# Altium schematic sheet usd.SchDoc
size A4
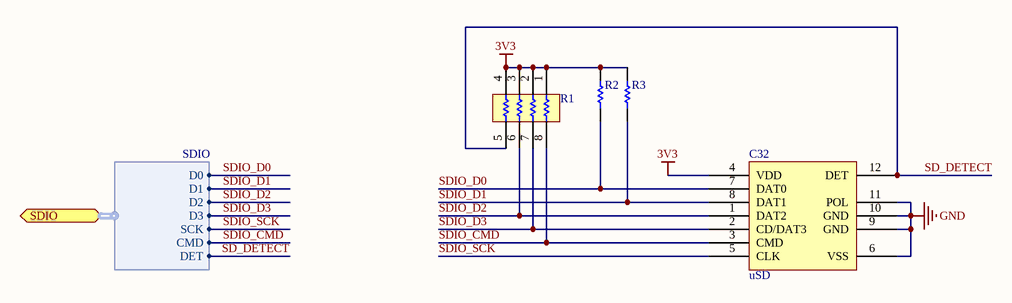
[diagram p0: usd.SchDoc]

## Parts
C32  uSD  [47309-XXX 3.35mm]
R1  CAY16-103J4LF  [BOUR-CAY16-J4_V]  (value not drawn)
R2  47K 5% 0402(1005)  [RESC0402(1005)_M]  (value not drawn)
R3  47K 5% 0402(1005)  [RESC0402(1005)_M]  (value not drawn)

## Ports
SDIO (harness SDIO)

## Harnesses
SDIO: D0, D1, D2, D3, SCK, CMD, DET

## Nets
3V3: C32.4(VDD) R1.1 R1.2 R1.3 R1.4 R2.2 R3.2
GND: C32.6(VSS) C32.9(GND) C32.10(GND) C32.11(POL)
SD_DETECT: C32.12(DET) R1.5 ; port SDIO.DET
SDIO_CMD: C32.3(CMD) R1.8 ; port SDIO.CMD
SDIO_D0: C32.7(DAT0) R2.1 ; port SDIO.D0
SDIO_D1: C32.8(DAT1) R3.1 ; port SDIO.D1
SDIO_D2: C32.1(DAT2) R1.6 ; port SDIO.D2
SDIO_D3: C32.2(CD/DAT3) R1.7 ; port SDIO.D3
SDIO_SCK: C32.5(CLK) ; port SDIO.SCK

## Library data of the parts
C32 = 47309-XXX: molex MICROSD/MICROSIM Connector
R1 = CMP-1747-00005-1: Chip Resistor Array, 10 KOhm, +/- 5%, 62.5 mW, -55 to 125 degC, 8-Pin SMD, RoHS, Tape and Reel; Power Rating: 100 mW; Case\Package: 0603; Voltage Rating: 75 V; Tolerance: 1%; Resistance: 220 Ohm; Packaging: Tape and Reel; Min Operating Temperature: -55 degC; Pins: 2; Radiation Hardening: No; DatasheetVersion: Jan-15; Length: 0.063 inch; RoHSCompliant: true; Mount: Surface Mount; ComponentLink1Description: Manufacturer URL; ComponentLink1URL: http://www.bourns.com/; Weight: 7.1E-05 oz; ComponentLink2URL: http://www.bourns.com/docs/Product-Datasheets/CATCAY.pdf; PackageReference: CAY16-J4; Width: 0.031 inch; Case Code (Imperial): 0603; Case Code (Metric): 1608; REACH SVHC: Yes; Max Operating Temperature: 155 degC; ComponentLink2Description: Datasheet; Height: 0.022 inch; PackageDescription: 8-Pin Surface Mount Device, Body 1.6 x 3.2 mm, Pitch 0.8 mm
R2 R3 = CMP-1011-00114-1: 47K 0.063W 5% 0402 (1005 Metric)  SMD; Case-EIA: 0402; Case-Metric: 1005; Value: 47000.00 Ohm; Tolerance: 5 %; Technology: SMT; Power: 0.063 W